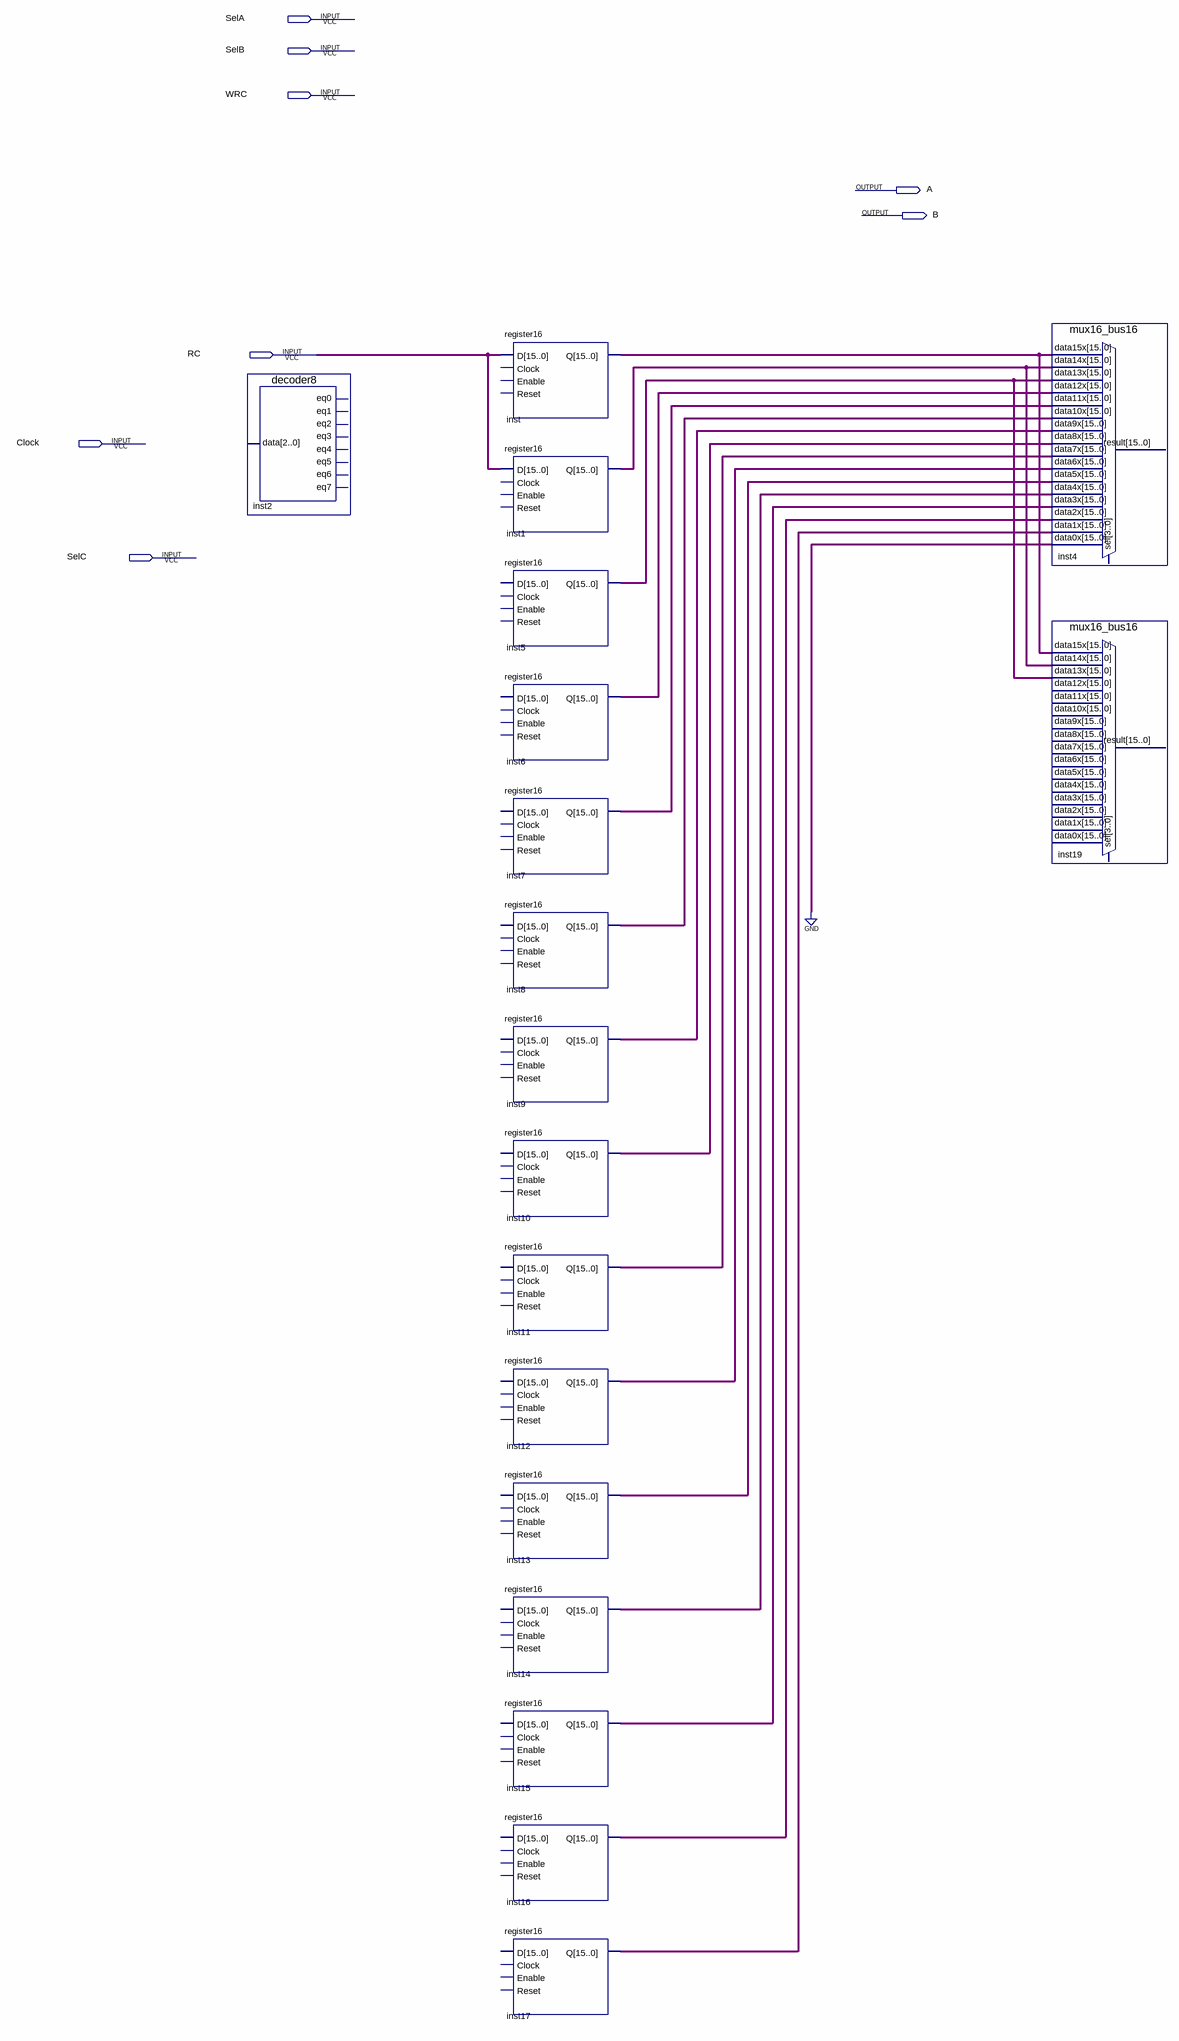
[diagram p0: schematic sheet]
// Quartus schematic register_bank16.bdf as structural Verilog: 18 symbols, 8 pins
module register_bank16 (
  input  SelA,
  input  SelB,
  input  WRC,
  input  RC,
  input  Clock,
  input  SelC,
  output A,
  output B
);

  wire [15:0] inst1_q, inst5_q, inst6_q, inst7_q, inst8_q, inst9_q, inst10_q, inst11_q, inst12_q, inst13_q,
       inst14_q, inst15_q, inst16_q, inst17_q, inst_q, undriven;

  decoder8 inst2 ();  // open: data, eq0, eq1, eq2, eq3, eq4, eq5, eq6, eq7
  register16 inst (.D(undriven), .Q(inst_q));  // open: Clock, Enable, Reset
  register16 inst1 (.D(undriven), .Q(inst1_q));  // open: Clock, Enable, Reset
  register16 inst5 (.Q(inst5_q));  // open: D, Clock, Enable, Reset
  register16 inst6 (.Q(inst6_q));  // open: D, Clock, Enable, Reset
  register16 inst7 (.Q(inst7_q));  // open: D, Clock, Enable, Reset
  register16 inst8 (.Q(inst8_q));  // open: D, Clock, Enable, Reset
  register16 inst9 (.Q(inst9_q));  // open: D, Clock, Enable, Reset
  register16 inst10 (.Q(inst10_q));  // open: D, Clock, Enable, Reset
  register16 inst11 (.Q(inst11_q));  // open: D, Clock, Enable, Reset
  register16 inst12 (.Q(inst12_q));  // open: D, Clock, Enable, Reset
  register16 inst13 (.Q(inst13_q));  // open: D, Clock, Enable, Reset
  register16 inst14 (.Q(inst14_q));  // open: D, Clock, Enable, Reset
  register16 inst15 (.Q(inst15_q));  // open: D, Clock, Enable, Reset
  register16 inst16 (.Q(inst16_q));  // open: D, Clock, Enable, Reset
  register16 inst17 (.Q(inst17_q));  // open: D, Clock, Enable, Reset
  mux16_bus16 inst4 (
    .data15x(inst_q), .data14x(inst1_q), .data13x(inst5_q), .data12x(inst6_q), .data11x(inst7_q),
    .data10x(inst8_q), .data9x(inst9_q), .data8x(inst10_q), .data7x(inst11_q), .data6x(inst12_q),
    .data5x(inst13_q), .data4x(inst14_q), .data3x(inst15_q), .data2x(inst16_q), .data1x(inst17_q),
    .data0x({16{1'b0}}));  // open: sel, result
  mux16_bus16 inst19 (
    .data15x(inst_q), .data14x(inst1_q), .data13x(inst5_q));  // open: data12x, data11x, data10x, data9x, data8x, data7x, data6x, data5x, data4x, data3x, data2x, data1x, data0x, sel, result
endmodule
